# EAGLE design 7segement4minidigits1badidea-mk-3 (EAGLE 6.5.0)
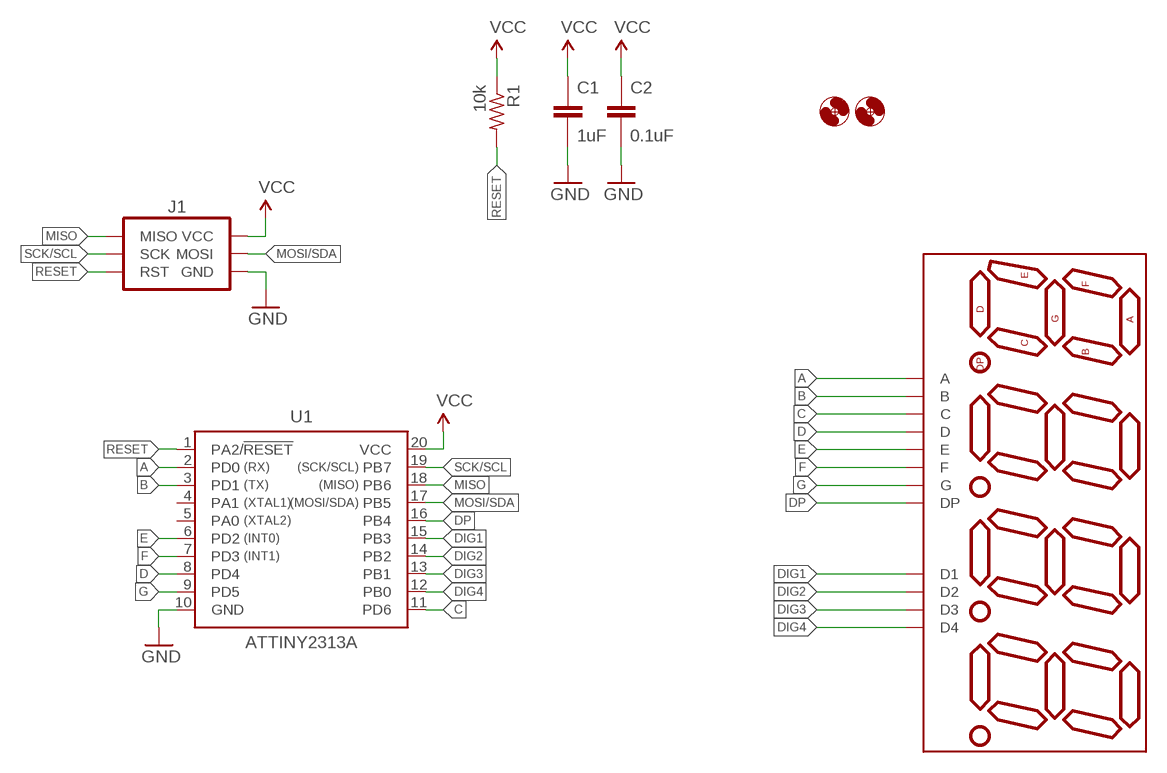
[diagram p0: schematic, sheet 1]

## Parts
BUBBLES!  (>^_^)>  7-SEGMENT-4DIGIT-COUNTERWAT  [DIP12-SMD-WAT]
C1  1uF  CAPACITOR-CERAMICC0805  [C0805]
C2  0.1uF  CAPACITOR-CERAMICC0603  [C0603]
H1  HOLE#2  [HOLE-#2]
H2  HOLE#2  [HOLE-#2]
J1  AVR_SPI_PRG_6PTH_INLINE_I2C  [AVR_ISP_INLINE_PTH_I2C]
R1  10k  RESISTORR0603  [R0603]
U1  ATTINY2313A  ATTINY2313ASOIC  [SOP20W]

## Nets
A: BUBBLES!.12(A) U1.2(PD0)
B: BUBBLES!.11(B) U1.3(PD1)
C: BUBBLES!.3(C) U1.11(PD6)
D: BUBBLES!.8(D) U1.8(PD4)
DIG1: BUBBLES!.1(D1) U1.15(PB3)
DIG2: BUBBLES!.10(D2) U1.14(PB2)
DIG3: BUBBLES!.4(D3) U1.13(PB1)
DIG4: BUBBLES!.6(D4) U1.12(PB0)
DP: BUBBLES!.5(DP) U1.16(PB4)
E: BUBBLES!.2(E) U1.6(PD2)
F: BUBBLES!.9(F) U1.7(PD3)
G: BUBBLES!.7(G) U1.9(PD5)
GND: C1.2 C2.2 J1.GND U1.10(GND)
MISO: J1.MISO U1.18(PB6)
MOSI/SDA: J1.MOSI U1.17(PB5)
RESET: J1.RESET(RST) R1.2 U1.1(PA2/!RESET)
SCK/SCL: J1.SCK U1.19(PB7)
VCC: C1.1 C2.1 J1.VCC R1.1 U1.20(VCC)
Unconnected: U1.4(PA1) U1.5(PA0)

## Library data of the parts
BUBBLES! = A_butts:7-SEGMENT-4DIGIT-COUNTER
C1 C2 = A_butts:CAPACITOR-CERAMIC: CAPACITOR, European symbol
H1 H2 = A_butts:HOLE: MOUNTING HOLE with drill center marker
J1 = A_butts:AVR_SPI_PRG_6: AVR ISP 6 Pin This is the reduced ISP connector for AVR programming. Common on Arduino. This footprint will take up less PCB space and can be used with a 10-pin to 6-pin adapter such as SKU: BOB-08508 **Special note about "TEST_POINT" package. The stop mask is on the top side, so if you want your programming test points to be on the bottom of your board, make sure to place this package on the bottom side of the board. This also ensure that the orientation to program from the bottom side will be correct.
R1 = A_butts:RESISTOR: RESISTOR, American symbol
U1 = A_butts:ATTINY2313A: ATTINY2313A 2kB 20MHz I2C/SPI/UART; PROD_ID: IC-11305

## Board
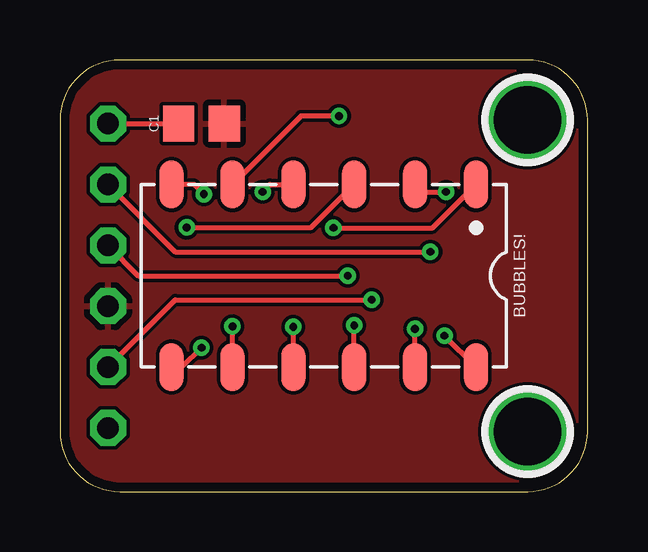
[diagram p1: board, top side]
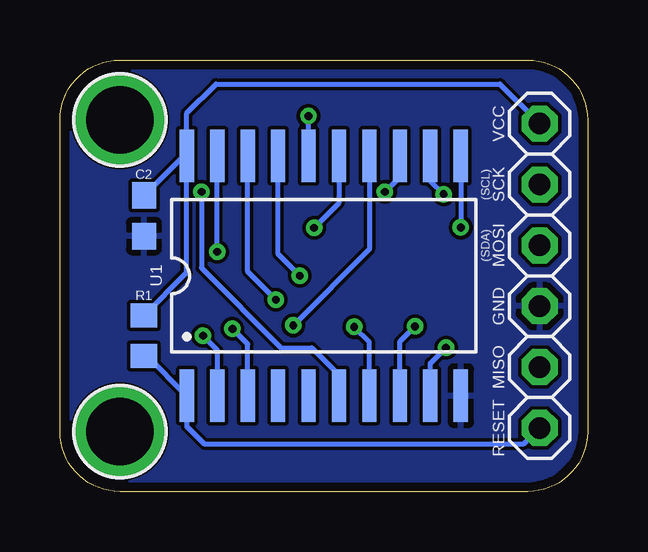
[diagram p2: board, bottom side, seen from below]

Size 22 x 18 mm. Coordinates in mm from the lower left corner, seen from the top.
Outline: 0,15.5 0,2.5 arc90 2.5,0 19.5,0 arc90 22,2.5 22,15.5 arc90 19.5,18 2.5,18 arc90 0,15.5
Copper layers (1*16): Top 0.0356mm / dielectric 1.5011mm / Bottom 0.0356mm
Design rules "LaenPCBOrder_2": minimum track width 6mil, minimum drill 13mil, track to track 6mil, track to pad 6mil, pad to pad 6mil, via to via 6mil, smd to smd 6mil, copper to edge 15mil, drill to drill 6mil, minimum pad ring 7mil, minimum via ring 7mil, stop-mask expansion 3mil, vias tented up to drill 20mil, thermal gap 10mil

### Footprints (pad centres in the part's own frame; a part is rotated, then mirrored left to right if it is on the bottom)
DIP12-SMD-WAT = smd 1 x 2: 1 -6.35,-3.81; 2 -3.81,-3.81; 3 -1.27,-3.81; 4 1.27,-3.81; 5 3.81,-3.81; 6 6.35,-3.81; 7 6.35,3.81; 8 3.81,3.81; 9 1.27,3.81; 10 -1.27,3.81; 11 -3.81,3.81; 12 -6.35,3.81
C0805 = smd 1.3 x 1.5: 1 -0.95,0; 2 0.95,0
C0603 = smd 1.1 x 1: 1 -0.85,0; 2 0.85,0
HOLE-#2 = drill 2.8 pad 3.81: P$1 0,0
AVR_ISP_INLINE_PTH_I2C = drill 0.9 pad 1.5 octagon: GND 1.27,0; MISO 3.81,0; MOSI -1.27,0; RESET 6.35,0; SCK -3.81,0; VCC -6.35,0
R0603 = smd 1 x 1.1: 1 -0.85,0; 2 0.85,0
SOP20W = smd 0.6 x 2.2: 1 -5.715,-5; 2 -4.445,-5; 3 -3.175,-5; 4 -1.905,-5; 5 -0.635,-5; 6 0.635,-5; 7 1.905,-5; 8 3.175,-5; 9 4.445,-5; 10 5.715,-5; 11 5.715,5; 12 4.445,5; 13 3.175,5; 14 1.905,5; 15 0.635,5; 16 -0.635,5; 17 -1.905,5; 18 -3.175,5; 19 -4.445,5; 20 -5.715,5

### Placement (x,y rotation side)
BUBBLES!  11,9 180 top
C1  5.9,15.35 0 top
C2  18.5,11.5 270 bottom
H1  19.5,2.5 0 top
H2  19.5,15.5 0 top
J1  2,9 270 bottom
R1  18.5,6.5 270 bottom
U1  11,9 0 bottom

### Tracks (layer width: path | path; a pad name or v marks a point on that pad's centre or on a via)
A  (via drill 0.33)
  Top 0.2: BUBBLES!.12 v16.04,6.5
  Bottom 0.2: v16.04,6.5 15.45,5.91 U1.2
B  (via drill 0.33)
  Top 0.2: BUBBLES!.11 v14.81,6.79
  Bottom 0.2: U1.3 14.18,6.16 v14.81,6.79
C  (via drill 0.33)
  Top 0.2: v5.29,11.02 10.47,11.02 BUBBLES!.3
  Bottom 0.2: U1.11 v5.29,11.02
D  (via drill 0.33)
  Top 0.2: BUBBLES!.8 v7.19,6.89
  Bottom 0.2: U1.8 7.83,6.25 v7.19,6.89
DIG1  (via drill 0.33)
  Top 0.2: v11.4,11 15.54,11 BUBBLES!.1
  Bottom 0.2: U1.15 10.37,12.04 v11.4,11
DIG2  (via drill 0.33)
  Top 0.2: BUBBLES!.10 v12.27,6.93
  Bottom 0.2: U1.14 9.1,10.11 v12.27,6.93
DIG3  (via drill 0.33)
  Top 0.2: v8.45,12.5 8.76,12.81 BUBBLES!.4
  Bottom 0.2: U1.13 7.83,13.12 v8.45,12.5
DIG4  (via drill 0.33)
  Top 0.2: v6,12.4 5.59,12.81 BUBBLES!.6
  Bottom 0.2: U1.12 6.55,12.96 v6,12.4
DP  (via drill 0.33)
  Top 0.2: v11.63,15.66 10.04,15.66 BUBBLES!.5
  Bottom 0.2: U1.16 v11.63,15.66
E  (via drill 0.33)
  Top 0.2: BUBBLES!.2 15.12,12.5 v16.1,12.5
  Bottom 0.2: v16.1,12.5 16.1,9.33 12.77,6 11.5,6 10.37,4.87 U1.6
F  (via drill 0.33)
  Top 0.2: BUBBLES!.9 v9.73,6.87
  Bottom 0.2: U1.7 9.1,6.24 v9.73,6.87
G  (via drill 0.33)
  Top 0.2: v5.9,6 5.09,5.19 BUBBLES!.7
  Bottom 0.2: U1.9 6.55,5.34 v5.9,6
GND
  pour Top: 19.5,0 2.5,0 arc-90 0,2.5 0,15.5 arc-90 2.5,18 19.5,18 arc-90 22,15.5 22,2.5 arc-90
  pour Bottom: 19.5,0 2.5,0 arc-90 0,2.5 0,15.5 arc-90 2.5,18 19.5,18 arc-90 22,15.5 22,2.5 arc-90
MISO  (via drill 0.33)
  Top 0.2: J1.MISO 4.81,8 v13,8
  Bottom 0.2: v13,8 14.18,9.18 U1.18
MOSI/SDA  (via drill 0.33)
  Top 0.2: J1.MOSI 3.27,9 v12,9
  Bottom 0.2: v12,9 12.9,9.9 U1.17
RESET
  Bottom 0.2: R1.2 18.36,5.65 U1.1 16.71,2.71 16,2 2.65,2 J1.RESET
SCK/SCL  (via drill 0.33)
  Top 0.2: J1.SCK 4.81,10 v15.45,10
  Bottom 0.2: v15.45,10 U1.19
VCC
  Top 0.2: J1.VCC C1.1
  Bottom 0.2: U1.20 16.85,14 C2.1 | U1.20 16.71,15.79 15.5,17 3.65,17 J1.VCC | R1.1 16.71,9.13 U1.20